# EasyEDA schematic 1-Schematic_ecg_biometrics.json
TITLE: Sheet_1; REV: 1.0; Date: 2021-06-27; Sheet: 1/1; Drawn By: opliko; Company: Your Company
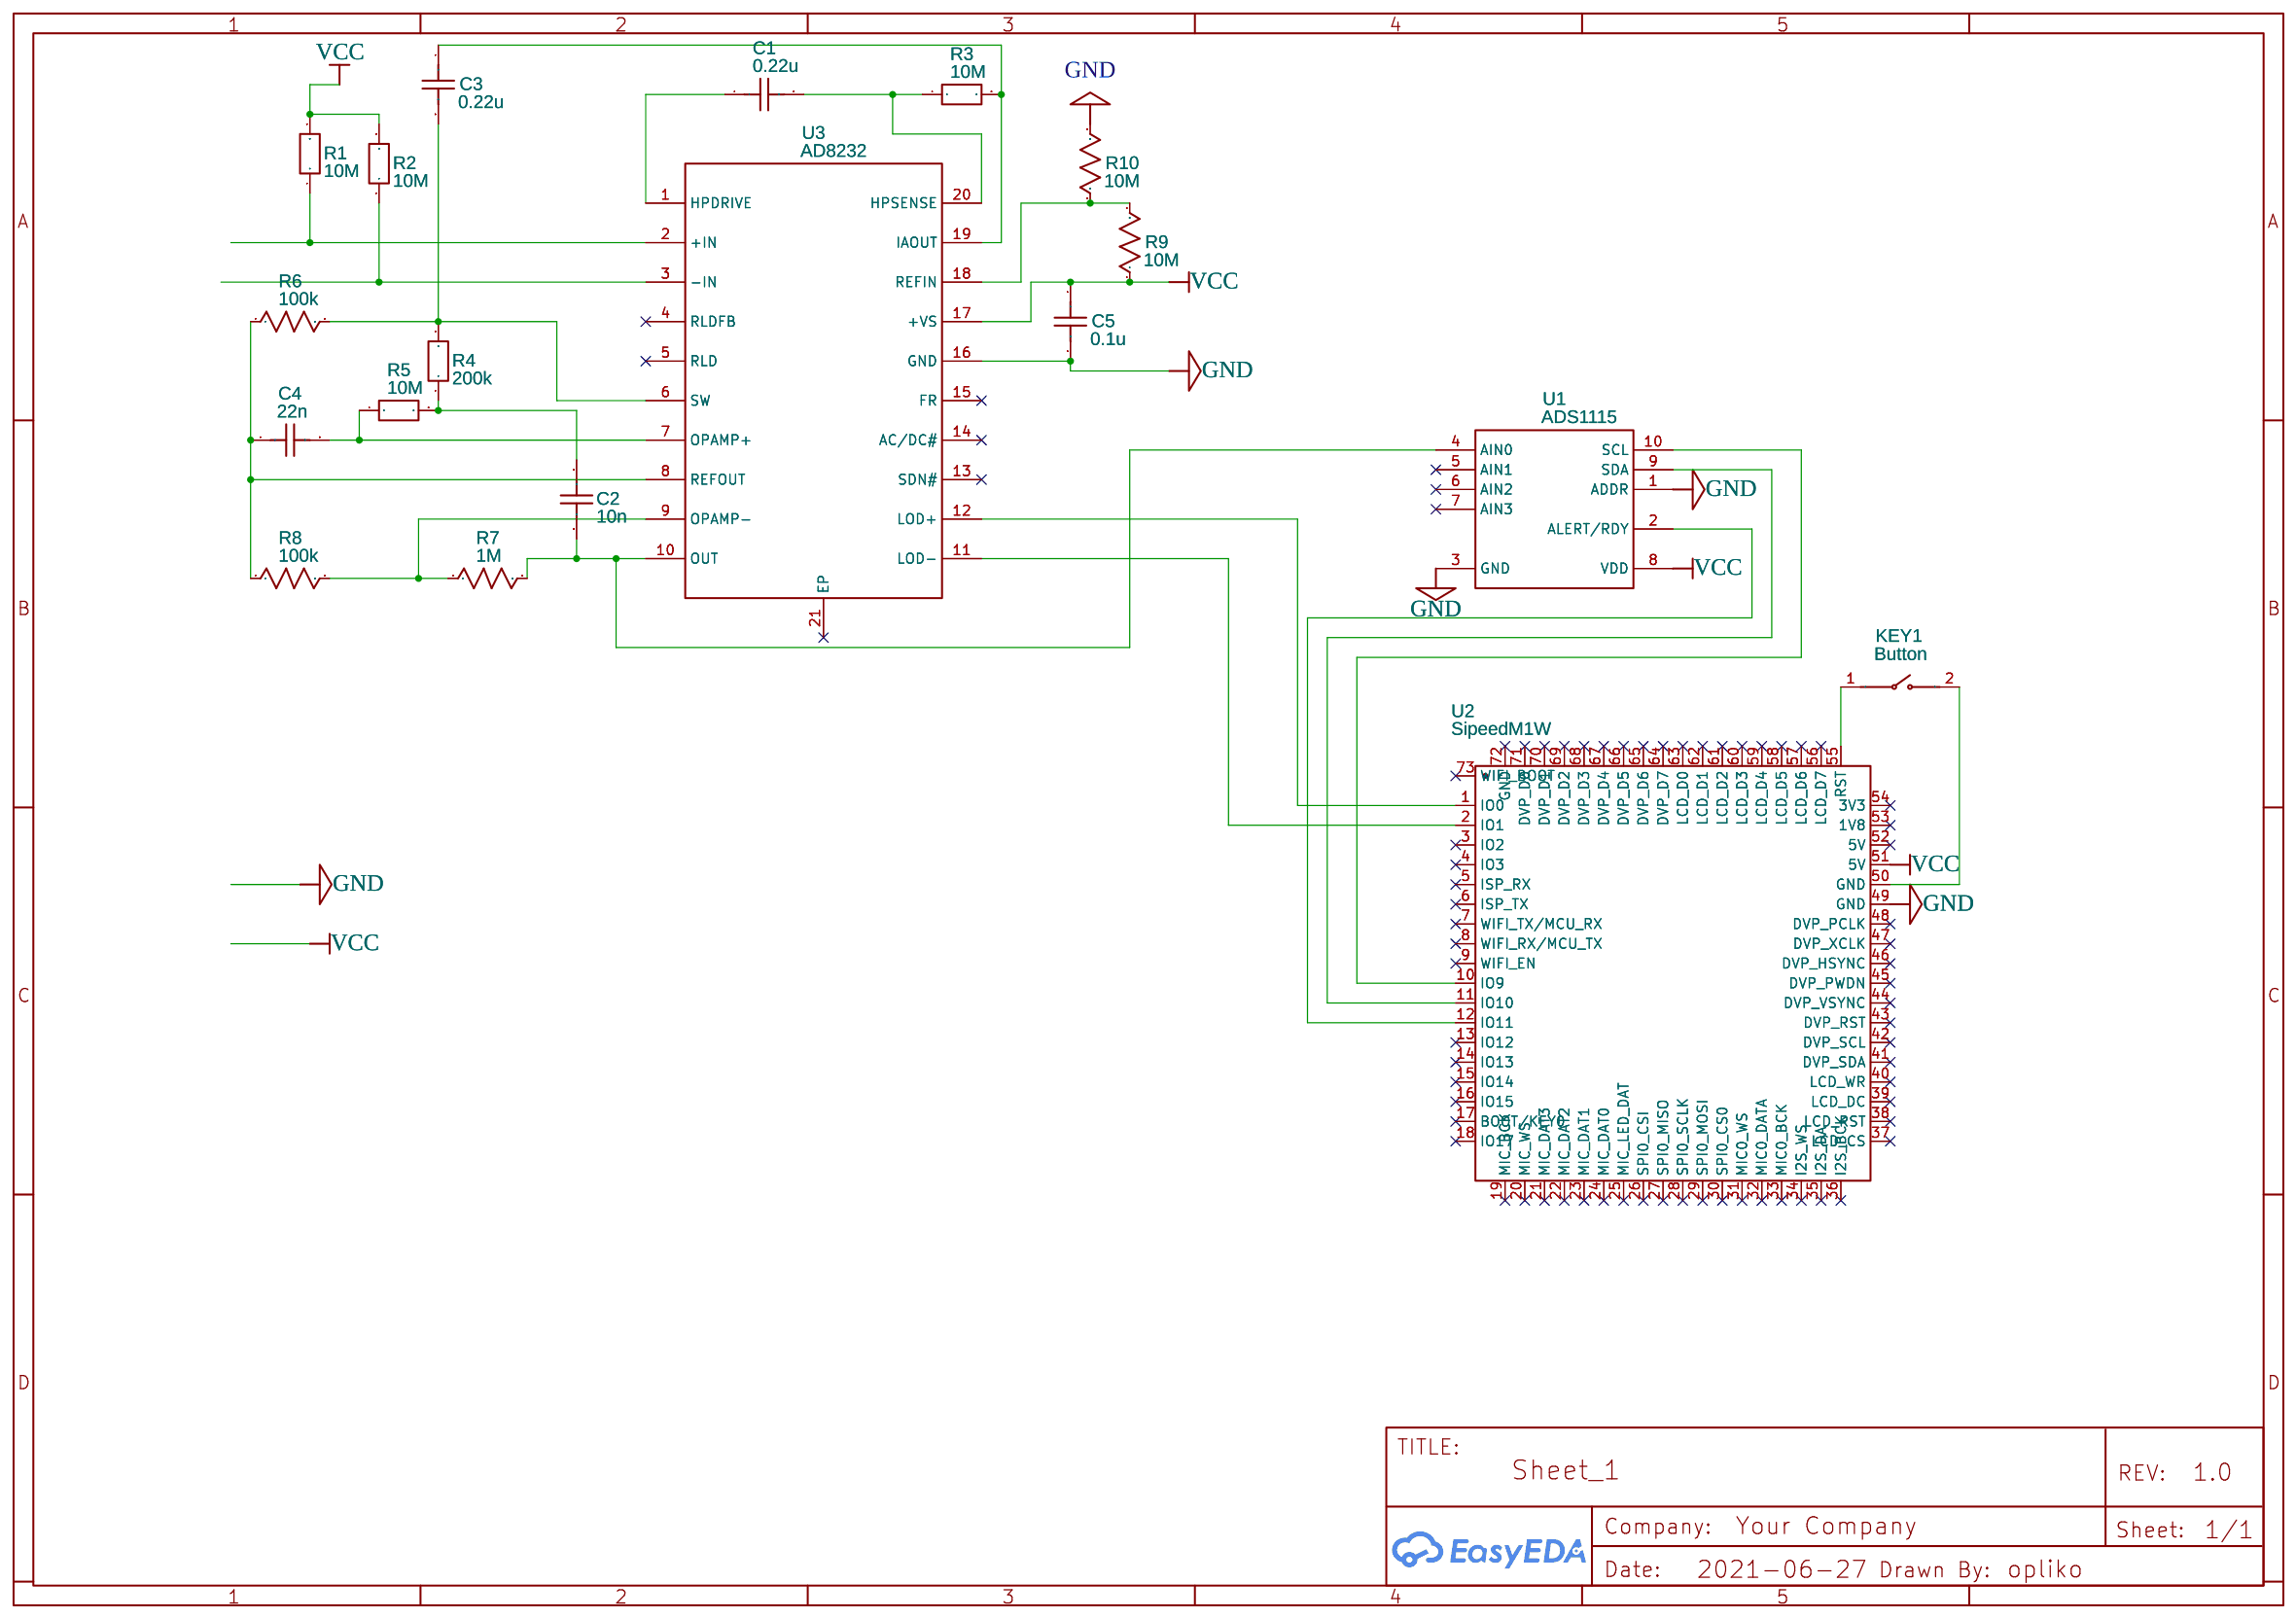
[diagram p0: schematic sheet]

## Parts
C1  0.22u  [C0603]
C2  10n  [C0603]
C3  0.22u  [C0603]
C4  22n  [C0603]
C5  0.1u  [C0603]
KEY1  Button  [BUTTONPCB]
R1  10M  [R0603]
R2  10M  [R0603]
R3  10M  [R0603]
R4  200k  [R0603]
R5  10M  [R0603]
R6  100k  [R0603]
R7  1M  [R0603]
R8  100k  [R0603]
R9  10M  [R0603]
R10  10M  [R0603]
U1  ADS1115  [MSOP-10]
U2  SipeedM1W  [SIPEED M1/M1W]
U3  AD8232  [LFCSP-20_L4.0-W4.0-P0.50-TL-EP2.7]

## Library data of the parts
C1-C5 = C_0603_US: Contributor: LCEDA_Lib
KEY1 = Button: Contributor: BlackBalance
R1-R5 = R_0603_EU: Contributor: LCEDA_Lib
R6-R10 = R_0603_US: Contributor: LCEDA_Lib
U1 = ADS1115: Supplier: LCSC; Manufacturer: TI; Manufacturer Part: ADS1115IDGSR; image: //image.lceda.cn/szlcsc/C37593.jpg; Supplier Part: C37593; LCSC Assembly: Yes; SMT Type: Extend
U2 = SipeedM1W: Manufacturer: Sipeed; Manufacturer Part: M1W; Supplier: spieed; link: http://dl.sipeed.com/MAIX/HDK/M1%26M1W/Specifications/Sipeed%20M1%20Specifications_EN%20V1.1.pdf; Contributor: comdet
U3 = AD8232: Manufacturer: Analog Devices; Manufacturer Part: AD8232ACPZ-R7; Supplier: LCSC; Supplier Part: C43216; link: https://www.analog.com/en/products/ad8232.html; Contributor: alexgubanow

## Nets
GND: C5.2 R10.2 U1.1(ADDR) U1.3(GND) U2.49(GND) U3.16(GND)
VCC: C5.1 R1.2 R2.2 R9.1 U1.8(VDD) U2.51(5V) U3.17(+VS)
Net-(C1-1): C1.1 U3.1(HPDRIVE)
Net-(C1-2): C1.2 R3.1 U3.20(HPSENSE)
Net-(C2-1): C2.1 R4.1 R5.2
Net-(C2-2): C2.2 R7.2 U1.4(AIN0) U3.10(OUT)
Net-(C3-1): C3.1 R3.2 U3.19(IAOUT)
Net-(C3-2): C3.2 R4.2 R6.2 U3.6(SW)
Net-(C4-1): C4.1 R6.1 R8.1 U3.8(REFOUT)
Net-(C4-2): C4.2 R5.1 U3.7(OPAMP+)
Net-(KEY1-1): KEY1.1 U2.55(RST)
Net-(KEY1-2): KEY1.2 U2.50(GND)
Net-(R1-1): R1.1 U3.2(+IN)
Net-(R2-1): R2.1 U3.3(-IN)
Net-(R7-1): R7.1 R8.2 U3.9(OPAMP-)
Net-(R9-2): R9.2 R10.1 U3.18(REFIN)
Net-(U1-2): U1.2(ALERT/RDY) U2.12(IO11)
Net-(U1-9): U1.9(SDA) U2.11(IO10)
Net-(U1-10): U1.10(SCL) U2.10(IO9)
Net-(U2-1): U2.1(IO0) U3.12(LOD+)
Net-(U2-2): U2.2(IO1) U3.11(LOD-)

Not connected (* = marked no-connect by the designer): U1 5(AIN1)* 6(AIN2)* 7(AIN3)*; U2 3(IO2)* 4(IO3)* 5(ISP_RX)* 6(ISP_TX)* 7(WIFI_TX/MCU_RX)* 8(WIFI_RX/MCU_TX)* 9(WIFI_EN)* 13(IO12)* 14(IO13)* 15(IO14)* 16(IO15)* 17(BOOT/KEY0)* 18(IO17)* 19(MIC_BCK)* 20(MIC_WS)* 21(MIC_DAT3)* 22(MIC_DAT2)* 23(MIC_DAT1)* 24(MIC_DAT0)* 25(MIC_LED_DAT)* 26(SPI0_CSI)* 27(SPI0_MISO)* 28(SPI0_SCLK)* 29(SPI0_MOSI)* 30(SPI0_CS0)* 31(MIC0_WS)* 32(MIC0_DATA)* 33(MIC0_BCK)* 34(I2S_WS)* 35(I2S_DA)* 36(I2S_BCK)* 37(LCD_CS)* 38(LCD_RST)* 39(LCD_DC)* 40(LCD_WR)* 41(DVP_SDA)* 42(DVP_SCL)* 43(DVP_RST)* 44(DVP_VSYNC)* 45(DVP_PWDN)* 46(DVP_HSYNC)* 47(DVP_XCLK)* 48(DVP_PCLK)* 52(5V)* 53(1V8)* 54(3V3)* 56(LCD_D7)* 57(LCD_D6)* 58(LCD_D5)* 59(LCD_D4)* 60(LCD_D3)* 61(LCD_D2)* 62(LCD_D1)* 63(LCD_D0)* 64(DVP_D7)* 65(DVP_D6)* 66(DVP_D5)* 67(DVP_D4)* 68(DVP_D3)* 69(DVP_D2)* 70(DVP_D1)* 71(DVP_D0)* 72(GND)* 73(WIFI_BOOT)*; U3 4(RLDFB)* 5(RLD)* 13(SDN#)* 14(AC/DC#)* 15(FR)* 21(EP)*
